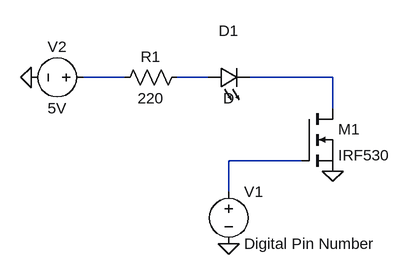
[diagram p0: schematic Sensor_Demo.asc]
Sensor_Demo.asc, the LTspice schematic file:
Version 4
SHEET 1 880 680
WIRE -144 48 -208 48
WIRE -16 48 -64 48
WIRE 176 48 48 48
WIRE 176 96 176 48
WIRE 128 176 16 176
WIRE 16 224 16 176
FLAG 176 192 0
FLAG -288 48 0
FLAG 16 304 0
SYMBOL nmos 128 96 R0
SYMATTR InstName M1
SYMATTR Value IRF530
SYMBOL voltage 16 208 R0
WINDOW 123 0 0 Left 0
WINDOW 39 0 0 Left 0
SYMATTR InstName V1
SYMATTR Value Digital Pin Number
SYMBOL LED -16 64 R270
WINDOW 0 72 32 VTop 2
WINDOW 3 0 32 VBottom 2
SYMATTR InstName D1
SYMBOL res -48 32 R90
WINDOW 0 0 56 VBottom 2
WINDOW 3 32 56 VTop 2
SYMATTR InstName R1
SYMATTR Value 220
SYMBOL voltage -192 48 R90
WINDOW 0 -32 56 VBottom 2
WINDOW 3 32 56 VTop 2
WINDOW 123 0 0 Left 0
WINDOW 39 0 0 Left 0
SYMATTR InstName V2
SYMATTR Value 5V

The netlist it stands for:
* Sensor_Demo.asc
M1 N003 N004 0 0 IRF530
V1 N004 0 Digital Pin Number
D1 N002 N003 D
R1 N002 N001 220
V2 N001 0 5V
.model D D
.lib standard.dio
.model NMOS NMOS
.model PMOS PMOS
.lib standard.mos
.backanno
.end